# Altium schematic sheet S7_IO.SchDoc
size A3
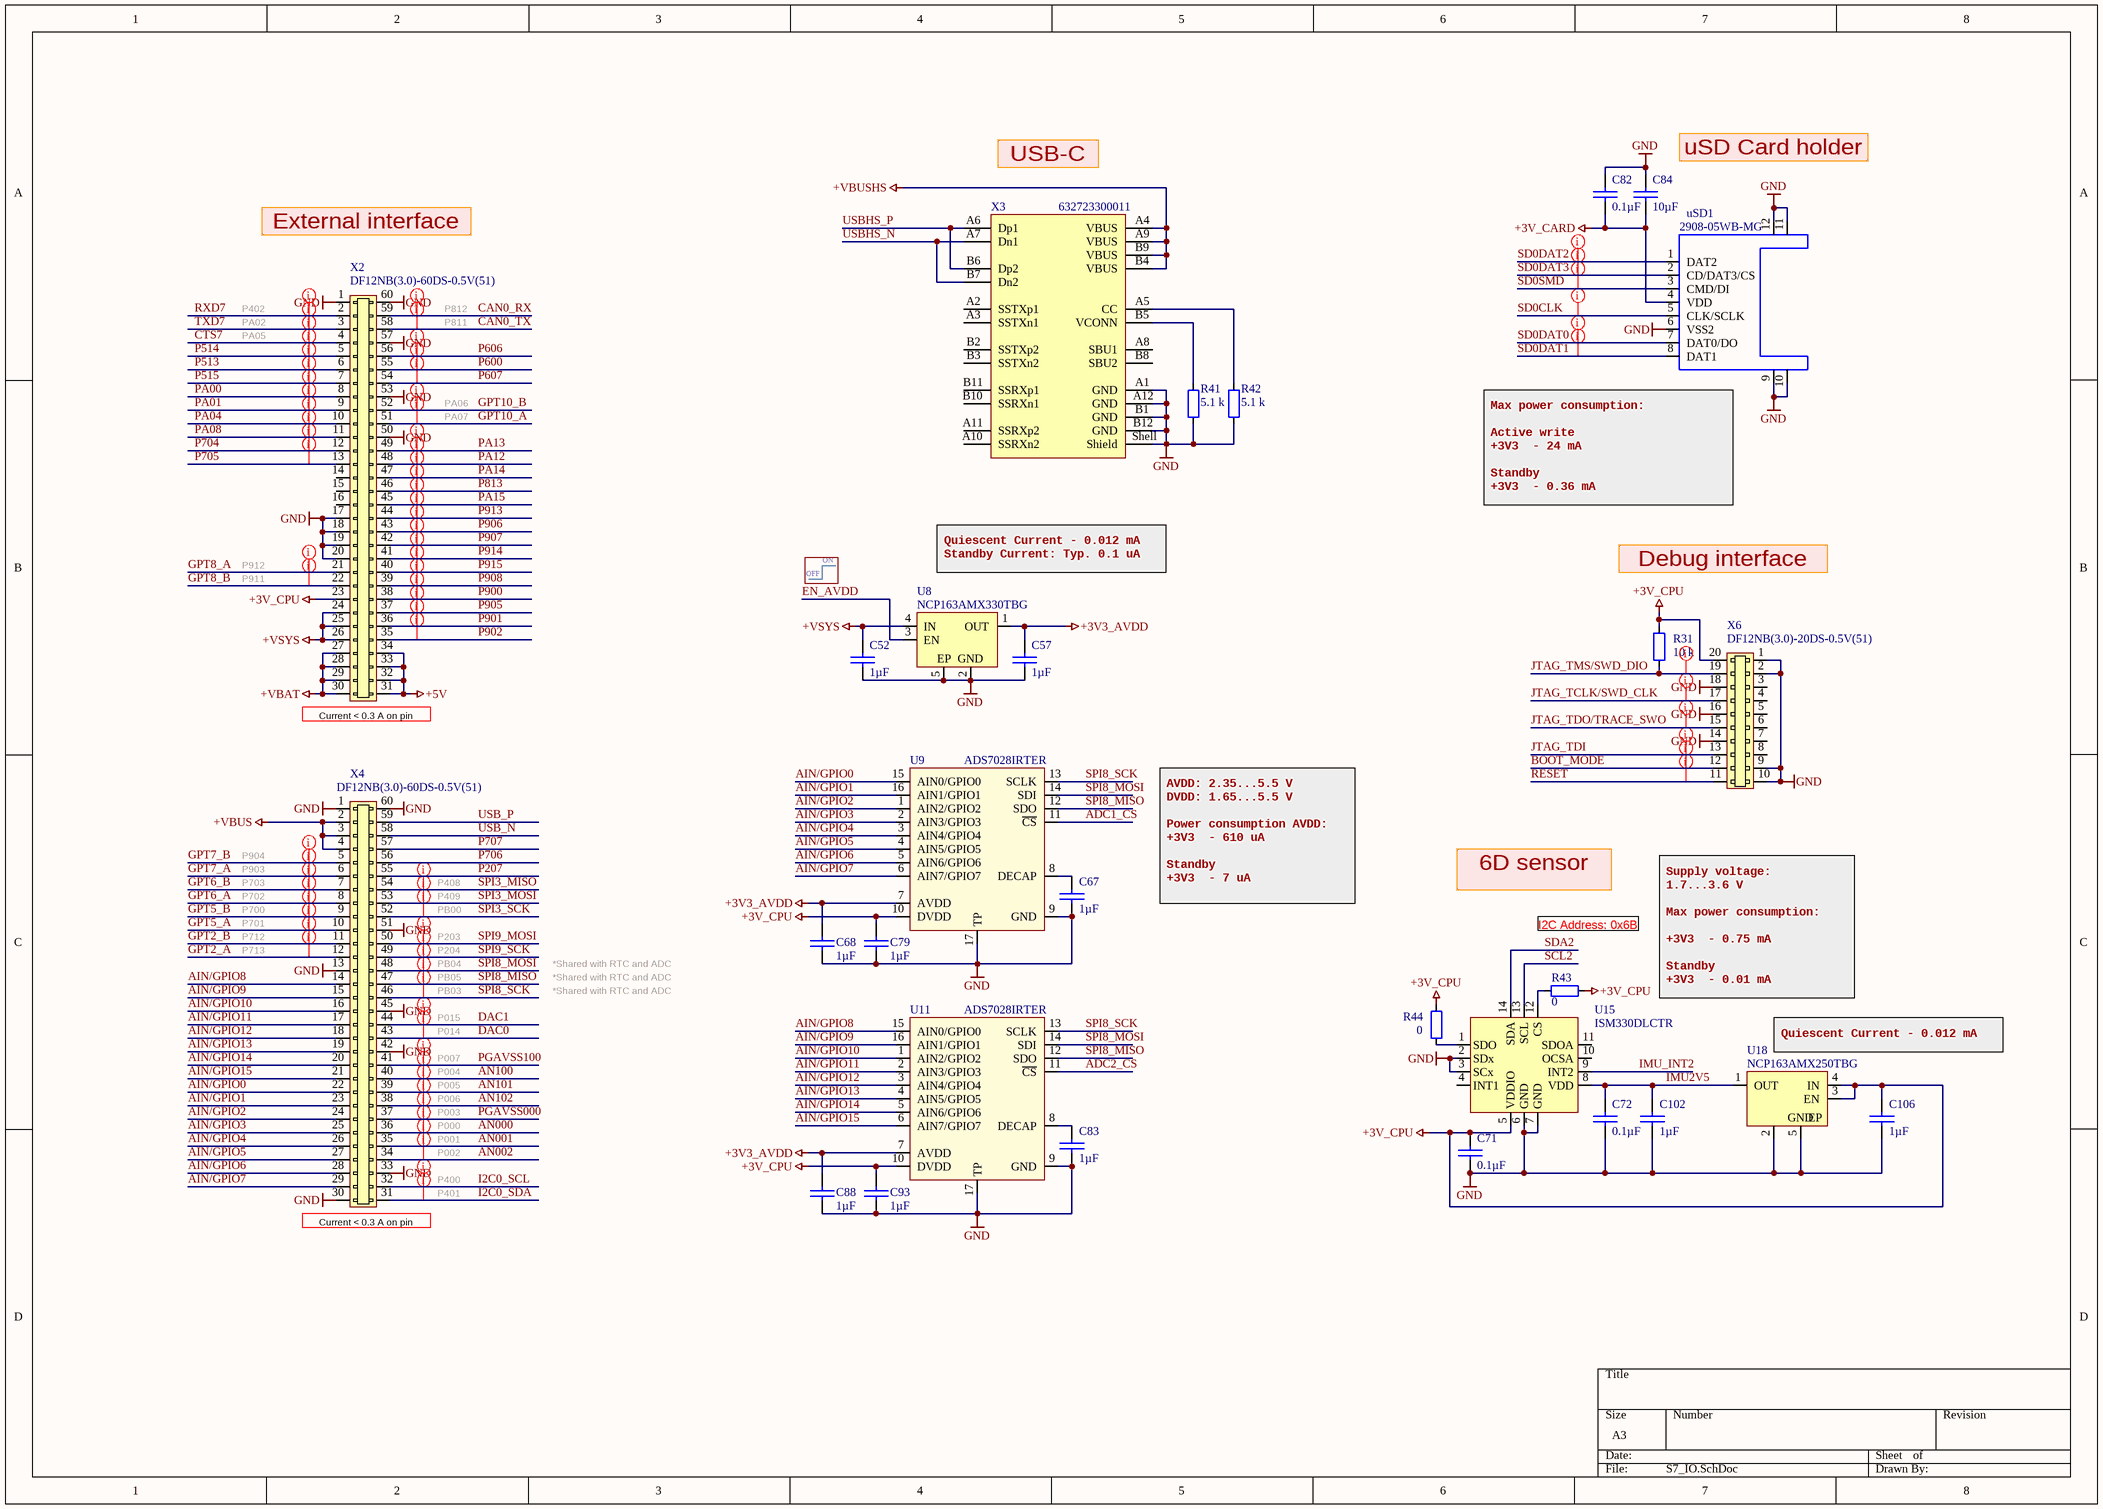
[diagram p0: S7_IO.SchDoc]

## Parts
C52  value 1µF  [0402 CAP]  (hidden comment: TMK105BJ105MV-F)
C57  value 1µF  [0402 CAP]  (hidden comment: TMK105BJ105MV-F)
C67  value 1µF  [0402 CAP]  (hidden comment: TMK105BJ105MV-F)
C68  value 1µF  [0402 CAP]  (hidden comment: TMK105BJ105MV-F)
C71  value 0.1µF  [0402 CAP]  (hidden comment: 0402B104K500CT)
C72  value 0.1µF  [0402 CAP]  (hidden comment: 0402B104K500CT)
C79  value 1µF  [0402 CAP]  (hidden comment: TMK105BJ105MV-F)
C82  value 0.1µF  [0402 CAP]  (hidden comment: 0402B104K500CT)
C83  value 1µF  [0402 CAP]  (hidden comment: TMK105BJ105MV-F)
C84  value 10µF  [0603 CAP]  (hidden comment: GRT188R61C106KE13D)
C88  value 1µF  [0402 CAP]  (hidden comment: TMK105BJ105MV-F)
C93  value 1µF  [0402 CAP]  (hidden comment: TMK105BJ105MV-F)
C102  value 1µF  [0402 CAP]  (hidden comment: TMK105BJ105MV-F)
C106  value 1µF  [0402 CAP]  (hidden comment: TMK105BJ105MV-F)
R31  value 10 k  [0402]  (hidden comment: RMCF0402FT10K0)
R41  value 5.1 k  [0402]  (hidden comment: RMCF0402FT5K10)
R42  value 5.1 k  [0402]  (hidden comment: RMCF0402FT5K10)
R43  value 0  [0402]  (hidden comment: WR04X000 PTL)
R44  value 0  [0402]  (hidden comment: WR04X000 PTL)
U8  NCP163AMX330TBG  [4-XDFN]
U9  ADS7028IRTER  [WQFN-16 3x3mm TI]
U11  ADS7028IRTER  [WQFN-16 3x3mm TI]
U15  ISM330DLCTR  [LGA-14 BOSCH]
U18  NCP163AMX250TBG  [4-XDFN]
uSD1  2908-05WB-MG  [2908-05WB-MG]
X2  DF12NB(3.0)-60DS-0.5V(51)  [DF12NB(3.0)-60DS-0.5V(51)]
X3  632723300011  [632723300011]
X4  DF12NB(3.0)-60DS-0.5V(51)  [DF12NB(3.0)-60DS-0.5V(51)]
X6  DF12NB(3.0)-20DS-0.5V(51)  [DF12NB(3.0)-20DS-0.5V(51)]

## Nets
+3V3_AVDD: C57.1 C68.1 C88.1 U8.1(OUT) U9.7(AVDD) U11.7(AVDD)
+3V_CARD: C82.2 C84.2 uSD1.4(VDD)
+3V_CPU: C71.1 C79.1 C93.1 C106.1 R31.2 R43.1 R44.2 U9.10(DVDD) U11.10(DVDD) U15.5(VDDIO) U18.3(EN) U18.4(IN) X2.23 X6.20
+5V: X2.31 X2.32 X2.33 X2.34
+VBAT: X2.27 X2.28 X2.29 X2.30
+VBUS: X4.2 X4.3 X4.4
+VBUSHS: X3.A4(VBUS) X3.A9(VBUS) X3.B4(VBUS) X3.B9(VBUS)
+VSYS: C52.1 U8.4(IN) X2.24 X2.25 X2.26
GND: C52.2 C57.2 C67.2 C68.2 C71.2 C72.2 C79.2 C82.1 C83.2 C84.1 C88.2 C93.2 C102.2 C106.2 R41.1 R42.1 U8.2(GND) U8.5(EP) U9.9(GND) U9.17(TP) U11.9(GND) U11.17(TP) U15.2(SDx) U15.3(SCx) U15.6(GND) U15.7(GND) U18.2(GND) U18.5(EP) uSD1.6(VSS2) uSD1.9 uSD1.10(WP) uSD1.11(GND) uSD1.12(GND) X2.1 X2.17 X2.18 X2.19 X2.20 X2.50 X2.53 X2.57 X2.60 X3.A1(GND) X3.A12(GND) X3.B1(GND) X3.B12(GND) X3.Shell(Shield) X4.1 X4.13 X4.30 X4.33 X4.42 X4.45 X4.51 X4.60 X6.1 X6.2 X6.9 X6.10 X6.14 X6.16 X6.18
ADC1_CS: U9.11(~{CS})
ADC2_CS: U11.11(~{CS})
AIN/GPIO0: U9.15(AIN0/GPIO0) X4.22
AIN/GPIO1: U9.16(AIN1/GPIO1) X4.23
AIN/GPIO2: U9.1(AIN2/GPIO2) X4.24
AIN/GPIO3: U9.2(AIN3/GPIO3) X4.25
AIN/GPIO4: U9.3(AIN4/GPIO4) X4.26
AIN/GPIO5: U9.4(AIN5/GPIO5) X4.27
AIN/GPIO6: U9.5(AIN6/GPIO6) X4.28
AIN/GPIO7: U9.6(AIN7/GPIO7) X4.29
AIN/GPIO8: U11.15(AIN0/GPIO0) X4.14
AIN/GPIO9: U11.16(AIN1/GPIO1) X4.15
AIN/GPIO10: U11.1(AIN2/GPIO2) X4.16
AIN/GPIO11: U11.2(AIN3/GPIO3) X4.17
AIN/GPIO12: U11.3(AIN4/GPIO4) X4.18
AIN/GPIO13: U11.4(AIN5/GPIO5) X4.19
AIN/GPIO14: U11.5(AIN6/GPIO6) X4.20
AIN/GPIO15: U11.6(AIN7/GPIO7) X4.21
AN000: X4.36
AN001: X4.35
AN002: X4.34
AN100: X4.40
AN101: X4.39
AN102: X4.38
BOOT_MODE: X6.12
CAN0_RX: X2.59
CAN0_TX: X2.58
CTS7: X2.4
DAC0: X4.43
DAC1: X4.44
EN_AVDD: U8.3(EN)
GPT2_A: X4.12
GPT2_B: X4.11
GPT5_A: X4.10
GPT5_B: X4.9
GPT6_A: X4.8
GPT6_B: X4.7
GPT7_A: X4.6
GPT7_B: X4.5
GPT8_A: X2.21
GPT8_B: X2.22
GPT10_A: X2.51
GPT10_B: X2.52
I2C0_SCL: X4.32
I2C0_SDA: X4.31
IMU2V5: C72.1 C102.1 U15.8(VDD) U18.1(OUT)
IMU_INT2: U15.9(INT2)
JTAG_TCLK/SWD_CLK: X6.17
JTAG_TDI: X6.13
JTAG_TDO/TRACE_SWO: X6.15
JTAG_TMS/SWD_DIO: R31.1 X6.19
P207: X4.55
P513: X2.6
P514: X2.5
P515: X2.7
P600: X2.55
P606: X2.56
P607: X2.54
P704: X2.12
P705: X2.13
P706: X4.56
P707: X4.57
P813: X2.46
P900: X2.38
P901: X2.36
P902: X2.35
P905: X2.37
P906: X2.43
P907: X2.42
P908: X2.39
P913: X2.44
P914: X2.41
P915: X2.40
PA00: X2.8
PA01: X2.9
PA04: X2.10
PA08: X2.11
PA12: X2.48
PA13: X2.49
PA14: X2.47
PA15: X2.45
PGAVSS000: X4.37
PGAVSS100: X4.41
RESET: X6.11
RXD7: X2.2
SCL2: U15.13(SCL)
SD0CLK: uSD1.5(CLK/SCLK)
SD0DAT0: uSD1.7(DAT0/DO)
SD0DAT1: uSD1.8(DAT1)
SD0DAT2: uSD1.1(DAT2)
SD0DAT3: uSD1.2(CD/DAT3/CS)
SD0SMD: uSD1.3(CMD/DI)
SDA2: U15.14(SDA)
SPI3_MISO: X4.54
SPI3_MOSI: X4.53
SPI3_SCK: X4.52
SPI8_MISO: U9.12(SDO) U11.12(SDO) X4.47
SPI8_MOSI: U9.14(SDI) U11.14(SDI) X4.48
SPI8_SCK: U9.13(SCLK) U11.13(SCLK) X4.46
SPI9_MOSI: X4.50
SPI9_SCK: X4.49
TXD7: X2.3
USB_N: X4.58
USB_P: X4.59
USBHS_N: X3.A7(Dn1) X3.B7(Dn2)
USBHS_P: X3.A6(Dp1) X3.B6(Dp2)
NetC67_1: C67.1 U9.8(DECAP)
NetC83_1: C83.1 U11.8(DECAP)
NetR41_2: R41.2 X3.B5(VCONN)
NetR42_2: R42.2 X3.A5(CC)
NetR43_2: R43.2 U15.12(CS)
NetR44_1: R44.1 U15.1(SDO)

Not connected (* = marked no-connect by the designer): U15 4(INT1) 10(OCSA) 11(SDOA); X2 14 15 16; X3 A2(SSTXp1) A3(SSTXn1) A8(SBU1) A10(SSRXn2) A11(SSRXp2) B2(SSTXp2) B3(SSTXn2) B8(SBU2) B10(SSRXn1) B11(SSRXp1); X6 3(2) 4(3) 5(3) 6(4) 7(4) 8(5)

## Layout directives
net class SWD: BOOT_MODE, JTAG_TCLK/SWD_CLK, JTAG_TDI, JTAG_TDO/TRACE_SWO, JTAG_TMS/SWD_DIO, RESET
net class uSD: SD0CLK, SD0DAT0, SD0DAT1, SD0DAT2, SD0DAT3, SD0SMD
net class AIN: AN000, AN001, AN002, AN100, AN101, AN102, PGAVSS000, PGAVSS100
net class I2C0: I2C0_SCL, I2C0_SDA
net class CSI8: SPI8_MISO, SPI8_MOSI, SPI8_SCK
net class CSI9: SPI9_MOSI, SPI9_SCK
net class CSI3: SPI3_MISO, SPI3_MOSI, SPI3_SCK
net class CAN0: CAN0_RX, CAN0_TX
net class CSI7: CTS7, RXD7, TXD7
net class TRACE: P813, PA12, PA13, PA14, PA15
net class MOTCTRL: GPT2_A, GPT2_B, GPT5_A, GPT5_B, GPT6_A, GPT6_B, GPT7_A, GPT7_B
net class ENCODER: GPT8_A, GPT8_B, GPT10_A, GPT10_B
net class P9: P900, P901, P902, P905, P906, P907, P908, P913, P914, P915
net class P5: P513, P514, P515
net class PA: PA00, PA01, PA04, PA08
net class P6: P600, P606, P607
net class P7: P704, P705
net class DAC: DAC0, DAC1

## Notes on the sheet
- USB-C
- (near C84) uSD Card holder
- External interface
- P402
- P812
- PA02
- PA05
- P811
- PA06
- PA07
- (near uSD1) Max power consumption:
  Active write
  +3V3  - 24 mA
  Standby
  +3V3  - 0.36 mA
- P912
- P911
- OFF
- ON
- Quiescent Current - 0.012 mA
  Standby Current: Typ. 0.1 uA
- Debug interface
- (near X2) Current < 0.3 A on pin
- P904
- P903
- P703
- P702
- P700
- P408
- P409
- PB00
- AVDD: 2.35...5.5 V
  DVDD: 1.65...5.5 V
  Power consumption AVDD:
  +3V3  - 610 uA
  Standby
  +3V3  - 7 uA
- 6D sensor
- P701
- P712
- P713
- P203
- P204
- PB04
- PB05
- PB03
- *Shared with RTC and ADC
- I2C Address: 0x6B
- Supply voltage:
  1.7...3.6 V
  Max power consumption:
  +3V3  - 0.75 mA
  Standby
  +3V3  - 0.01 mA
- P015
- P014
- (near U18) Quiescent Current - 0.012 mA
- P007
- P004
- P005
- P006
- P003
- P000
- P001
- P002
- P400
- (near X4) Current < 0.3 A on pin
- P401

## Library data of the parts
C52 C57 C67 C68 C79 C83 C88 C93 C102 C106 = TMK105BJ105MV-F: 1µF, ±20%, 25V, X5R, 0402 (1005 Metric), -55°C ~ 85°C, -, General Purpose; Manufacturer: Taiyo Yuden; PartNum: 587-3245-1-ND; Voltage - Rated: 25V; Part Number: TMK105BJ105MV-F; Distributor: Digi-Key; PartName: TMK105BJ105MV-F; Price: 0.22000; Tolerance: ±20%; Temperature Coefficient: X5R; Operating Temperature: -55°C ~ 85°C; Features: -; Package / Case: 0402 (1005 Metric)
C71 C72 C82 = 0402B104K500CT: 0.1µF, ±10%, 50V, X7R, 0402 (1005 Metric), -55°C ~ 125°C, -, General Purpose; Manufacturer: Walsin Technology Corporation; PartNum: 1292-1176-1-ND; Voltage - Rated: 50V; Part Number: 0402B104K500CT; Distributor: Digi-Key; PartName: 0402B104K500CT; Price: 0.19000; Tolerance: ±10%; Temperature Coefficient: X7R; Operating Temperature: -55°C ~ 125°C; Features: -; Package / Case: 0402 (1005 Metric)
C84 = GRT188R61C106KE13D: 10µF, ±10%, 16V, X5R, 0603 (1608 Metric), -55°C ~ 85°C, -, Automotive; Manufacturer: Murata Electronics North America; PartNum: 490-12317-1-ND; Voltage - Rated: 16V; Part Number: GRT188R61C106KE13D; Distributor: Digi-Key; PartName: GRT188R61C106KE13D; Price: 0.22770; Tolerance: ±10%; Temperature Coefficient: X5R; Operating Temperature: -55°C ~ 85°C; Features: -; Package / Case: 0603 (1608 Metric)
R31 = RMCF0402FT10K0: 10 kOhms, ±1%, 0.063W, 1/16W, Thick Film, ±100ppm/°C, 0402 (1005 Metric), -55°C ~ 155°C, Automotive AEC-Q200; Manufacturer: Stackpole Electronics Inc; PartNum: RMCF0402FT10K0CT-ND; Voltage: 75V; Distributor: Digi-Key; Price: 0.10000; Tolerance: ±1%; PartName: RMCF0402FT10K0; Part Number: RMCF0402FT10K0; Temperature Coefficient: ±100ppm/°C; Operating Temperature: -55°C ~ 155°C; Power (Watts): 0.063W, 1/16W; Features: Automotive AEC-Q200; Package / Case: 0402 (1005 Metric)
R41 R42 = RMCF0402FT5K10: 5.1 kOhms, ±1%, 0.063W, 1/16W, Thick Film, ±100ppm/°C, 0402 (1005 Metric), -55°C ~ 155°C, Automotive AEC-Q200; Manufacturer: Stackpole Electronics Inc; PartNum: RMCF0402FT5K10CT-ND; Voltage: 75V; Distributor: Digi-Key; Price: 0.10000; Tolerance: ±1%; PartName: RMCF0402FT5K10; Part Number: RMCF0402FT5K10; Temperature Coefficient: ±100ppm/°C; Operating Temperature: -55°C ~ 155°C; Power (Watts): 0.063W, 1/16W; Features: Automotive AEC-Q200; Package / Case: 0402 (1005 Metric)
R43 R44 = WR04X000 PTL: 0 Ohms Jumper 0.063W, 1/16W Chip Resistor 0402 (1005 Metric) Thick Film; Manufacturer: Walsin Technology Corporation; PartNum: 1292-WR04X000PTLCT-ND; Voltage: 50 V; Distributor: Digi-Key; Price: 0.002$; PartName: WR04X000 PTL
U8 = NCP163AMX330TBG: LDO 3.3V, 250 mA, Vin < 5.5V, Iq < 20uA, -40..+125 C,  4-XDFN (1x1); Manufacturer: ON Semiconductor; PartNum: NCP163AMX330TBGOSCT-ND; Price: 0.41$; Distributor: Digi-Key; PartName: NCP163AMX330TBG; Supplier 1: RSComponents; Supplier Part Number 1: 1349547P
U9 U11 = ADS7028IRTER: 12 Bit Analog to Digital Converter 8 Input 1 SAR, 2.35V ~ 5.5V, 16-WQFN (3x3),  -40°C ~ 85°C; Manufacturer: Texas Instruments; PartNum: 296-ADS7028IRTERCT-ND; Distributor: Digi-Key; Price: 5.1$; PartName: ADS7028IRTER; Supplier 1: Digi-Key; Supplier Part Number 1: 296-ADS7028IRTERCT-ND
U15 = ISM330DLCTR: Accelerometer, Gyroscope, Temperature, 3 Axis Sensor I²C, SPI , -40°C ~ 85°C, 14-LGA (2.5x3); Manufacturer: STMicroelectronics; PartNum: 497-17583-1-ND; Price: 6.28$; Distributor: Digi-Key; PartName: ISM330DLCTR
U18 = NCP163AMX250TBG: LDO 2.5V, 250 mA, Vin < 5.5V, Iq < 20uA, -40..+125 C,  4-XDFN (1x1); Manufacturer: ON Semiconductor; PartNum: NCP163AMX250TBGOSCT-ND; Price: 0.41$; Distributor: Digi-Key; PartName: NCP163AMX250TBG
uSD1 = 2908-05WB-MG: microSD cadr holder; Manufacturer: 3M; Price: 2.71$; Distributor: Farnell; PartNum: 2908-05WB-MG; PartName: 2908-05WB-MG; Supplier 1: RSComponents; Supplier Part Number 1: 212799
X2 X4 = DF12NB(3.0)-60DS-0.5V(51): 60 Position Connector Receptacle, Center Strip Contacts Surface Mount Gold, height 2.2 mm, pitch 0.5 mm, Mated Stacking Heights 3mm; Manufacturer: Hirose Electric; PartNum: 26-DF12NB(3.0)-60DS-0.5V(51)CT-ND; Price: 1.33$; Distributor: Digi-Key; PartName: DF12NB(3.0)-60DS-0.5V(51); Supplier 1: Digi-Key; Supplier Part Number 1: 26-DF12NB(3.0)-60DS-0.5V(51)CT-ND
X3 = 632723300011: WR-USB 3.1 Type C, Receptacle, Horizontal, THR; Manufacturer: Wurth Elektronik; Interface Type: Type C; Number of Ports: 1; Rated Current: 5A; Working Voltage: 20VAC; ComponentLink1Description: Website Link; ComponentLink1URL: https://www.we-online.com/redexpert/article/632723300011?ad; ComponentLink2Description: Datasheet Link; ComponentLink2URL: https://www.we-online.com/redexpert/spec/632723300011?ad; Manufacturer Part Number: 632723300011; Category: Input/Output Connectors; Match Code: WR-USB; Mount: Surface Mount; Operating Temperature Max: 105°C; Operating Temperature Min: -40°C; Packaging: Tape and Reel; Application: USB 3.1; Gender: Receptacle; Number of Pins: 24; Orientation: Horizontal; Supplier 1: RSComponents; Supplier Part Number 1: 1622301P
X6 = DF12NB(3.0)-20DS-0.5V(51): 20 Position Connector Receptacle, Center Strip Contacts Surface Mount Gold, height 2.2 mm, pitch 0.5 mm, Mated Stacking Heights 3mm; Manufacturer: Hirose Electric; PartNum: 26-DF12NB(3.0)-20DS-0.5V(51)CT-ND - Cut Tape (CT); Price: 064$; Distributor: Digi-Key; PartName: DF12NB(3.0)-20DS-0.5V(51); Supplier 1: Farnell; Supplier Part Number 1: 3587388